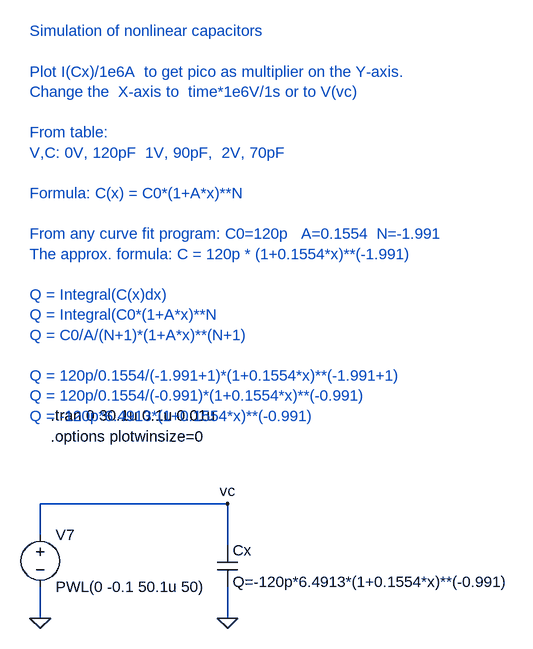
[diagram p0: schematic nonlinear_capacitance2.asc]
nonlinear_capacitance2.asc, the LTspice schematic file:
Version 4
SHEET 1 1804 1860
WIRE 64 -128 64 -176
WIRE 64 0 64 -48
WIRE 352 -176 64 -176
WIRE 352 -112 352 -176
WIRE 352 0 352 -48
FLAG 64 0 0
FLAG 352 0 0
FLAG 352 -176 vc
SYMBOL cap 336 -112 R0
SYMATTR InstName Cx
SYMATTR Value Q=-120p*6.4913*(1+0.1554*x)**(-0.991)
SYMBOL voltage 64 -144 R0
WINDOW 123 0 0 Left 0
WINDOW 39 0 0 Left 0
SYMATTR InstName V7
SYMATTR Value PWL(0 -0.1 50.1u 50)
TEXT 80 -312 Left 0 !.tran 0 30.1u 0.1u 0.01u
TEXT 48 -904 Left 0 ;Simulation of nonlinear capacitors\n \nPlot I(Cx)/1e6A  to get pico as multiplier on the Y-axis.\nChange the  X-axis to  time*1e6V/1s or to V(vc)\n \nFrom table: \nV,C: 0V, 120pF  1V, 90pF,  2V, 70pF\n \nFormula: C(x) = C0*(1+A*x)**N\n \nFrom any curve fit program: C0=120p   A=0.1554  N=-1.991\nThe approx. formula: C = 120p * (1+0.1554*x)**(-1.991)\n \nQ = Integral(C(x)dx)   \nQ = Integral(C0*(1+A*x)**N\nQ = C0/A/(N+1)*(1+A*x)**(N+1)\n \nQ = 120p/0.1554/(-1.991+1)*(1+0.1554*x)**(-1.991+1)\nQ = 120p/0.1554/(-0.991)*(1+0.1554*x)**(-0.991)\nQ = -120p*6.4913*(1+0.1554*x)**(-0.991)
TEXT 80 -280 Left 0 !.options plotwinsize=0

The netlist it stands for:
* nonlinear_capacitance2.asc
Cx vc 0 Q=-120p*6.4913*(1+0.1554*x)**(-0.991)
V7 vc 0 PWL(0 -0.1 50.1u 50)
.tran 0 30.1u 0.1u 0.01u
* Simulation of nonlinear capacitors
* Plot I(Cx)/1e6A  to get pico as multiplier on the Y-axis.
* Change the  X-axis to  time*1e6V/1s or to V(vc)
* From table:
* V,C: 0V, 120pF  1V, 90pF,  2V, 70pF
* Formula: C(x) = C0*(1+A*x)**N
* From any curve fit program: C0=120p   A=0.1554  N=-1.991
* The approx. formula: C = 120p * (1+0.1554*x)**(-1.991)
* Q = Integral(C(x)dx)
* Q = Integral(C0*(1+A*x)**N
* Q = C0/A/(N+1)*(1+A*x)**(N+1)
* Q = 120p/0.1554/(-1.991+1)*(1+0.1554*x)**(-1.991+1)
* Q = 120p/0.1554/(-0.991)*(1+0.1554*x)**(-0.991)
* Q = -120p*6.4913*(1+0.1554*x)**(-0.991)
.options plotwinsize=0
.backanno
.end